# EAGLE design led_panel (EAGLE 9.1.3)
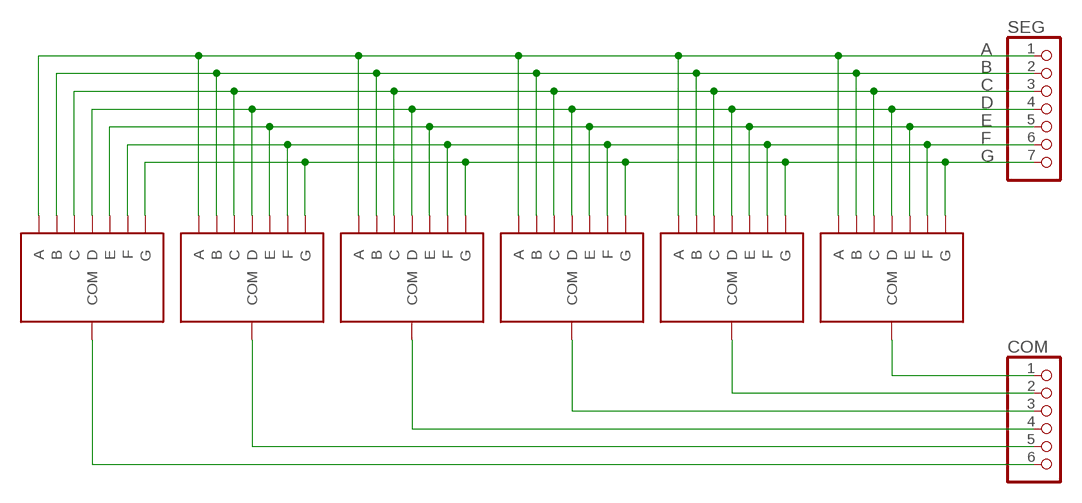
[diagram p0: schematic, sheet 1]

## Parts
COM  PINHD-1X6  [1X06]
SEG  PINHD-1X7  [1X07]
U$1  7SEGMENTLED  [7SEGMENTLED]
U$2  7SEGMENTLED  [7SEGMENTLED]
U$3  7SEGMENTLED  [7SEGMENTLED]
U$4  7SEGMENTLED  [7SEGMENTLED]
U$5  7SEGMENTLED  [7SEGMENTLED]
U$6  7SEGMENTLED  [7SEGMENTLED]

## Nets
A: SEG.1 U$1.P$4(A) U$2.P$4(A) U$3.P$4(A) U$4.P$4(A) U$5.P$4(A) U$6.P$4(A)
B: SEG.2 U$1.P$5(B) U$2.P$5(B) U$3.P$5(B) U$4.P$5(B) U$5.P$5(B) U$6.P$5(B)
C: SEG.3 U$1.P$9(C) U$2.P$9(C) U$3.P$9(C) U$4.P$9(C) U$5.P$9(C) U$6.P$9(C)
D: SEG.4 U$1.P$7(D) U$2.P$7(D) U$3.P$7(D) U$4.P$7(D) U$5.P$7(D) U$6.P$7(D)
E: SEG.5 U$1.P$6(E) U$2.P$6(E) U$3.P$6(E) U$4.P$6(E) U$5.P$6(E) U$6.P$6(E)
F: SEG.6 U$1.P$2(F) U$2.P$2(F) U$3.P$2(F) U$4.P$2(F) U$5.P$2(F) U$6.P$2(F)
G: SEG.7 U$1.P$1(G) U$2.P$1(G) U$3.P$1(G) U$4.P$1(G) U$5.P$1(G) U$6.P$1(G)
N$1: COM.6 U$1.P$3(COM) U$1.P$8(COM) U$1.P$10(COM)
N$2: COM.5 U$2.P$3(COM) U$2.P$8(COM) U$2.P$10(COM)
N$3: COM.4 U$3.P$3(COM) U$3.P$8(COM) U$3.P$10(COM)
N$4: COM.3 U$4.P$3(COM) U$4.P$8(COM) U$4.P$10(COM)
N$5: COM.2 U$5.P$3(COM) U$5.P$8(COM) U$5.P$10(COM)
N$6: COM.1 U$6.P$3(COM) U$6.P$8(COM) U$6.P$10(COM)

## Library data of the parts
COM = pinhead:PINHD-1X6: PIN HEADER
SEG = pinhead:PINHD-1X7: PIN HEADER
U$1-U$6 = teslacoil:7SEGMENTLED

## Board
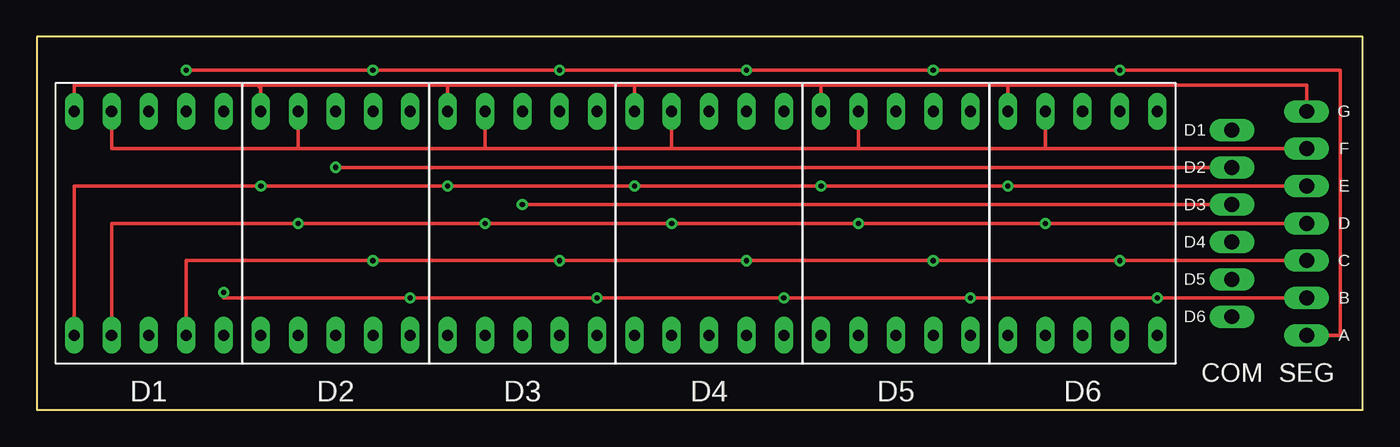
[diagram p1: board, top side]
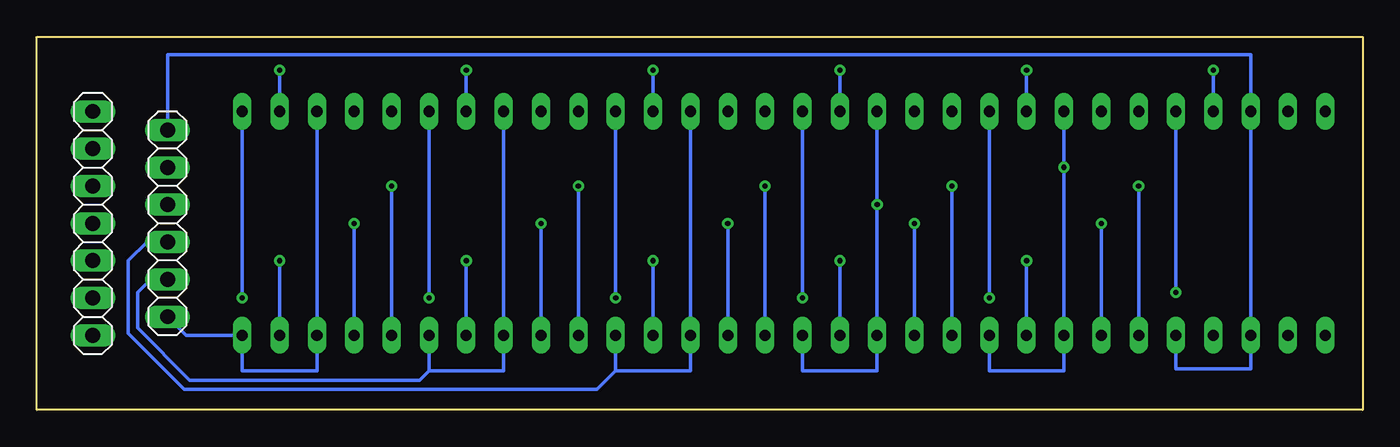
[diagram p2: board, bottom side, seen from below]

Size 90.17 x 25.4 mm. Coordinates in mm from the lower left corner, seen from the top.
Outline: 0,0 90.17,0 90.17,25.4 0,25.4 0,0
Copper layers (1*16): Top 0.035mm / dielectric 1.5mm / Bottom 0.035mm
Design rules "default *": minimum track width 6mil, minimum drill 0.35mm, track to track 6mil, track to pad 6mil, pad to pad 6mil, via to via 6mil, smd to smd 6mil, copper to edge 40mil, drill to drill 6mil, minimum pad ring 10mil, minimum via ring 8mil, stop-mask expansion 4mil, vias tented up to drill 20mil, thermal gap 10mil

### Footprints (pad centres in the part's own frame; a part is rotated, then mirrored left to right if it is on the bottom)
1X06 = drill 1.016 long: 1 -6.35,0; 2 -3.81,0; 3 -1.27,0; 4 1.27,0; 5 3.81,0; 6 6.35,0
1X07 = drill 1.016 long: 1 -7.62,0; 2 -5.08,0; 3 -2.54,0; 4 0,0; 5 2.54,0; 6 5.08,0; 7 7.62,0
7SEGMENTLED = drill 0.75 long: P$1 -5.08,7.62; P$2 -2.54,7.62; P$3 0,7.62; P$4 2.54,7.62; P$5 5.08,7.62; P$6 -5.08,-7.62; P$7 -2.54,-7.62; P$8 0,-7.62; P$9 2.54,-7.62; P$10 5.08,-7.62

### Placement (x,y rotation side)
COM  81.28,12.7 270 bottom
SEG  86.36,12.7 90 bottom
U$1  71.12,12.7 0 top
U$2  58.42,12.7 0 top
U$3  45.72,12.7 0 top
U$4  33.02,12.7 0 top
U$5  20.32,12.7 0 top
U$6  7.62,12.7 0 top

### Tracks (layer width: path | path; a pad name or v marks a point on that pad's centre or on a via)
A  (via drill 0.35)
  Top 0.254: v10.16,23.11 v22.86,23.11 v35.56,23.11 v48.26,23.11 v60.96,23.11 v73.66,23.11 88.65,23.11 88.65,5.08 SEG.1
  Bottom 0.254: U$6.P$4 v10.16,23.11 | v22.86,23.11 U$5.P$4 | v35.56,23.11 U$4.P$4 | v48.26,23.11 U$3.P$4 | v60.96,23.11 U$2.P$4 | v73.66,23.11 U$1.P$4
B  (via drill 0.35)
  Top 0.254: v12.7,8 12.7,7.62 v25.4,7.62 v38.1,7.62 v50.8,7.62 v63.5,7.62 v76.2,7.62 SEG.2
  Bottom 0.254: v12.7,8 U$6.P$5 | U$5.P$5 v25.4,7.62 | U$4.P$5 v38.1,7.62 | U$3.P$5 v50.8,7.62 | U$2.P$5 v63.5,7.62 | U$1.P$5 v76.2,7.62
C  (via drill 0.35)
  Top 0.254: U$6.P$9 10.16,10.16 v22.86,10.16 v35.56,10.16 v48.26,10.16 v60.96,10.16 v73.66,10.16 SEG.3
  Bottom 0.254: U$5.P$9 v22.86,10.16 | U$4.P$9 v35.56,10.16 | U$3.P$9 v48.26,10.16 | U$2.P$9 v60.96,10.16 | U$1.P$9 v73.66,10.16
D  (via drill 0.35)
  Top 0.254: U$6.P$7 5.08,12.7 v17.78,12.7 v30.48,12.7 v43.18,12.7 v55.88,12.7 v68.58,12.7 SEG.4
  Bottom 0.254: U$5.P$7 v17.78,12.7 | U$4.P$7 v30.48,12.7 | U$3.P$7 v43.18,12.7 | U$2.P$7 v55.88,12.7 | U$1.P$7 v68.58,12.7
E  (via drill 0.35)
  Top 0.254: U$6.P$6 2.54,15.24 v15.24,15.24 v27.94,15.24 v40.64,15.24 v53.34,15.24 v66.04,15.24 SEG.5
  Bottom 0.254: U$5.P$6 v15.24,15.24 | U$4.P$6 v27.94,15.24 | U$3.P$6 v40.64,15.24 | U$2.P$6 v53.34,15.24 | U$1.P$6 v66.04,15.24
F
  Top 0.254: 17.78,17.78 5.08,17.78 U$6.P$2 | 17.78,17.78 30.48,17.78 | 30.48,17.78 43.18,17.78 | 43.18,17.78 55.88,17.78 | 55.88,17.78 68.58,17.78 | U$5.P$2 17.78,17.78 | U$4.P$2 30.48,17.78 | U$3.P$2 43.18,17.78 | U$2.P$2 55.88,17.78 | U$1.P$2 68.58,17.78 | SEG.6 68.58,17.78
G
  Top 0.254: U$6.P$1 2.54,22.1 15.24,22.1 | 15.24,22.1 27.94,22.1 | 27.94,22.1 40.64,22.1 | 40.64,22.1 53.34,22.1 | 66.04,22.1 86.36,22.1 SEG.7 | U$3.P$1 40.64,22.1 | U$5.P$1 15.24,21.97 15.11,21.97 15.24,22.1 | U$4.P$1 27.94,22.1 | U$2.P$1 53.34,22.1 | U$1.P$1 66.04,22.1 | 53.34,22.1 66.04,22.1
N$1
  Bottom 0.254: U$1.P$3 U$1.P$8 71.12,2.67 76.2,2.67 U$1.P$10 80.01,5.08 COM.6
N$2
  Top 0.254: COM.5 82.42,8.89
  Bottom 0.254: U$2.P$3 U$2.P$8 58.42,2.67 63.5,2.67 | 63.5,2.67 U$2.P$10 | 63.5,2.67 64.14,2.03 79.76,2.03 83.31,5.59 83.31,8 82.42,8.89 COM.5
N$3
  Top 0.254: COM.4 82.68,11.43
  Bottom 0.254: U$3.P$3 U$3.P$8 45.72,2.67 50.8,2.67 | 50.8,2.67 U$3.P$10 | 50.8,2.67 52.07,1.4 80.14,1.4 83.95,5.21 83.95,10.16 82.68,11.43 COM.4
N$4  (via drill 0.35)
  Top 0.254: COM.3 v33.02,13.97
  Bottom 0.254: U$4.P$3 v33.02,13.97 U$4.P$8 33.02,2.67 38.1,2.67 U$4.P$10
N$5  (via drill 0.35)
  Top 0.254: COM.2 v20.32,16.51
  Bottom 0.254: U$5.P$3 v20.32,16.51 U$5.P$8 20.32,2.67 25.4,2.67 U$5.P$10
N$6
  Bottom 0.254: U$6.P$10 12.7,2.79 7.62,2.79 U$6.P$8 U$6.P$3 7.62,24.18 81.28,24.18 COM.1

### Text on the board
tPlace: G | D1 | F | D2 | E | D3 | D | D4 | C | D5 | B | D6 | A | D1 | D2 | D3 | D4 | D5 | D6